# EasyEDA Pro project 电源板.epro

# Schematic Schematic2
Assembly Variant: Basic; Board Name: Board2; Create Date: 2026-05-31; Page Name: P1; Project Name: 信号电源板; Schematic Name: Schematic2; Update Date: 2026-05-31; BladeWidth: 10; Company: 嘉立创EDA; Page Size: A4; RegionStart: 1; ShowBorder: 1; TitleBlock: 1; TitleBlockPosition: 3; Version: V1.0; XRegionCount: 6; YRegionCount: 4
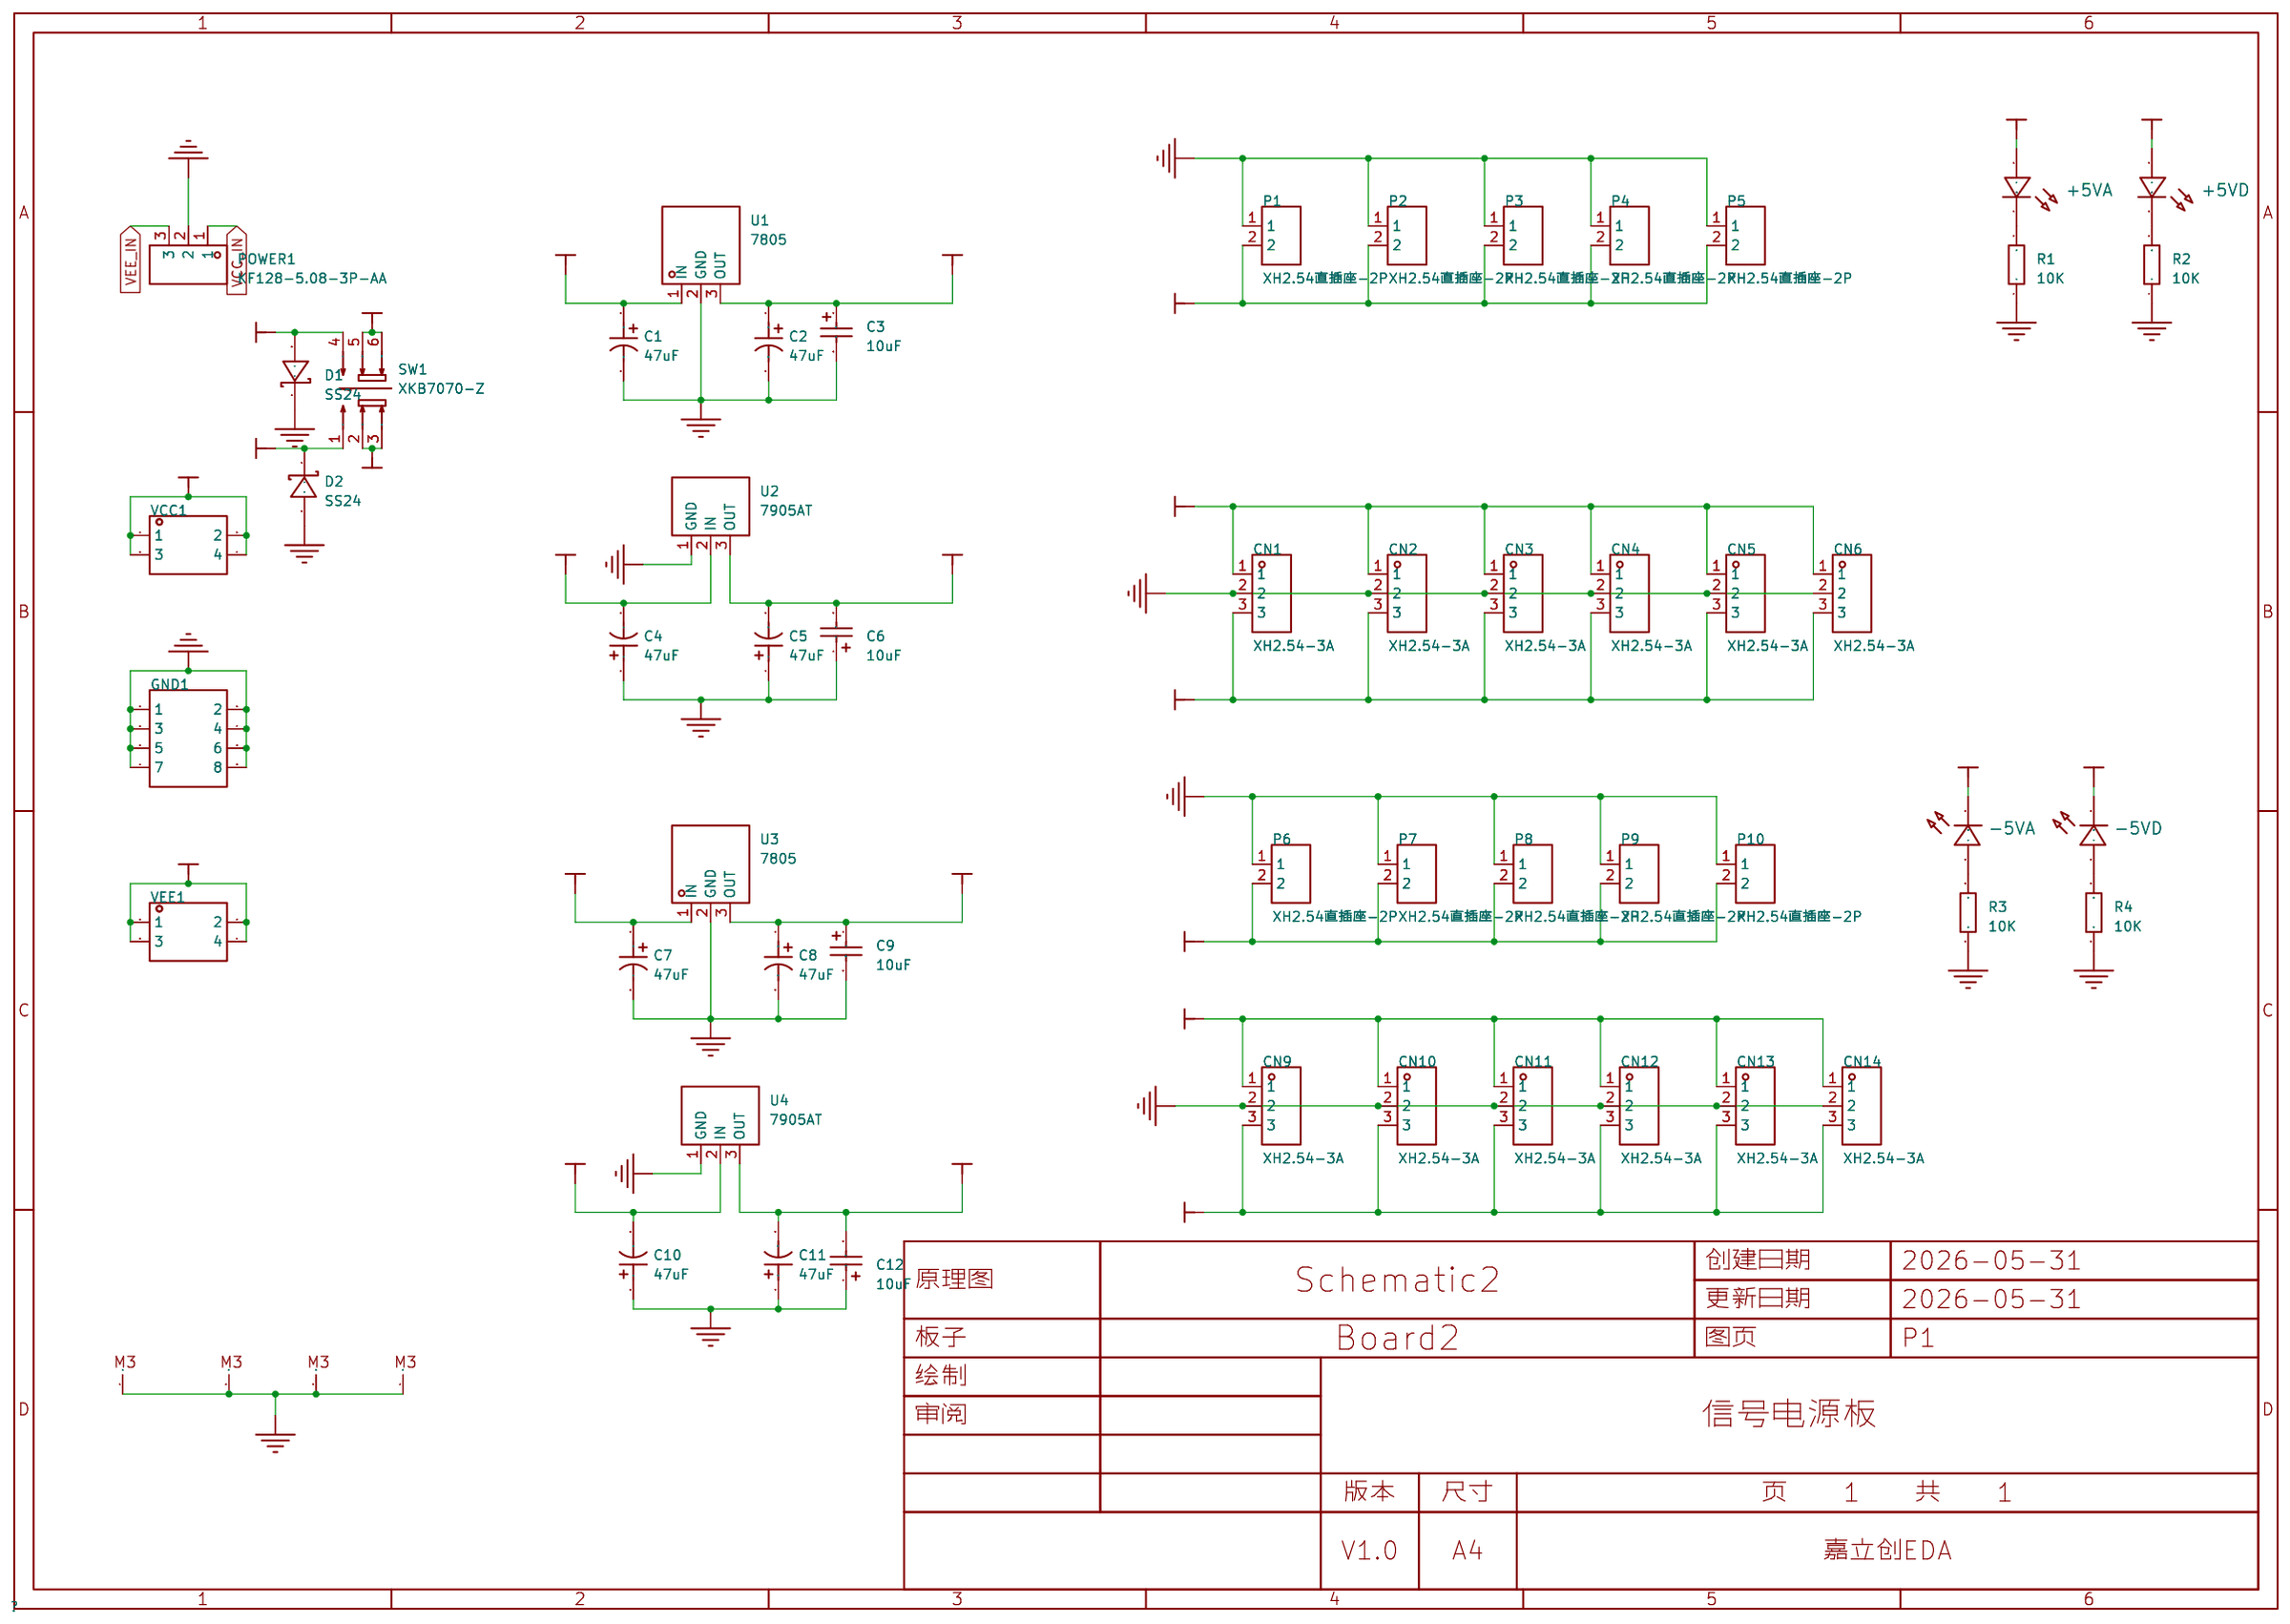
[diagram p0: schematic sheet]

## Parts
+5VA  -  [LED_0603]
+5VD  -  [LED_0603]
-5VA  -  [LED_0603]
-5VD  -  [LED_0603]
C1  47uF  [CAP-SMD_BD6.3-L6.6-W6.6-LS7.3-FD]
C2  47uF  [CAP-SMD_BD6.3-L6.6-W6.6-LS7.3-FD]
C3  10uF  [CAP-SMD_L3.2-W1.6-RD-C7171]
C4  47uF  [CAP-SMD_BD6.3-L6.6-W6.6-LS7.3-FD]
C5  47uF  [CAP-SMD_BD6.3-L6.6-W6.6-LS7.3-FD]
C6  10uF  [CAP-SMD_L3.2-W1.6-RD-C7171]
C7  47uF  [CAP-SMD_BD6.3-L6.6-W6.6-LS7.3-FD]
C8  47uF  [CAP-SMD_BD6.3-L6.6-W6.6-LS7.3-FD]
C9  10uF  [CAP-SMD_L3.2-W1.6-RD-C7171]
C10  47uF  [CAP-SMD_BD6.3-L6.6-W6.6-LS7.3-FD]
C11  47uF  [CAP-SMD_BD6.3-L6.6-W6.6-LS7.3-FD]
C12  10uF  [CAP-SMD_L3.2-W1.6-RD-C7171]
CN1  XH2.54-3A  [CONN-TH_3P-P2.50_HCTL_XH-3A-L]
CN2  XH2.54-3A  [CONN-TH_3P-P2.50_HCTL_XH-3A-L]
CN3  XH2.54-3A  [CONN-TH_3P-P2.50_HCTL_XH-3A-L]
CN4  XH2.54-3A  [CONN-TH_3P-P2.50_HCTL_XH-3A-L]
CN5  XH2.54-3A  [CONN-TH_3P-P2.50_HCTL_XH-3A-L]
CN6  XH2.54-3A  [CONN-TH_3P-P2.50_HCTL_XH-3A-L]
CN9  XH2.54-3A  [CONN-TH_3P-P2.50_HCTL_XH-3A-L]
CN10  XH2.54-3A  [CONN-TH_3P-P2.50_HCTL_XH-3A-L]
CN11  XH2.54-3A  [CONN-TH_3P-P2.50_HCTL_XH-3A-L]
CN12  XH2.54-3A  [CONN-TH_3P-P2.50_HCTL_XH-3A-L]
CN13  XH2.54-3A  [CONN-TH_3P-P2.50_HCTL_XH-3A-L]
CN14  XH2.54-3A  [CONN-TH_3P-P2.50_HCTL_XH-3A-L]
D1  SS24  [SMA_L4.3-W2.6-LS5.2-RD]
D2  SS24  [SMA_L4.3-W2.6-LS5.2-RD]
GND1  -  [HDR-TH_8P-P2.54-V-F-R2-C4-S2.54-1]
M1  -  [M3]
M2  -  [M3]
M3  -  [M3]
M4  -  [M3]
P1  XH2.54直插座-2P  [CONN-TH_XH2.54-2P]
P2  XH2.54直插座-2P  [CONN-TH_XH2.54-2P]
P3  XH2.54直插座-2P  [CONN-TH_XH2.54-2P]
P4  XH2.54直插座-2P  [CONN-TH_XH2.54-2P]
P5  XH2.54直插座-2P  [CONN-TH_XH2.54-2P]
P6  XH2.54直插座-2P  [CONN-TH_XH2.54-2P]
P7  XH2.54直插座-2P  [CONN-TH_XH2.54-2P]
P8  XH2.54直插座-2P  [CONN-TH_XH2.54-2P]
P9  XH2.54直插座-2P  [CONN-TH_XH2.54-2P]
P10  XH2.54直插座-2P  [CONN-TH_XH2.54-2P]
POWER1  KF128-5.08-3P-AA  [CONN-TH_3P-P5.08_KF128-5.08-3P]
R1  10K  [R0603]
R2  10K  [R0603]
R3  10K  [R0603]
R4  10K  [R0603]
SW1  XKB7070-Z  [SW-TH_6P-L7.0-W7.0-P2.00]
U1  7805  [TO-220-3_L10.2-W4.5-P2.54-L-1]
U2  7905AT  [TO-220AB-3_L10.1-W4.6-P2.54-L]
U3  7805  [TO-220-3_L10.2-W4.5-P2.54-L-1]
U4  7905AT  [TO-220AB-3_L10.1-W4.6-P2.54-L]
VCC1  -  [HDR-TH_4P-P2.54-V-F-R2-C2-S2.54]
VEE1  -  [HDR-TH_4P-P2.54-V-F-R2-C2-S2.54]

## Library data of the parts
+5VA +5VD -5VA -5VD = LED_0603-R: Supplier Footprint: 0603
C1 C2 C4 C5 C7 C8 C10 C11 = 126RV0104: 容值:47uF;精度:±20%;额定电压:63V;纹波电流:90mA;; LCSC Part Name: 47uF ±20% 63V; Supplier Part: C7461235; Manufacturer: KNSCHA(科尼盛); Supplier Footprint: SMD,D6.3xL7.7mm; JLCPCB Part Class: Extended Part; Datasheet: https://atta.szlcsc.com/upload/public/pdf/source/20230711/6451BDCB5B323B6F7EF00B061BF0BEEC.pdf; Supplier: LCSC; Tolerance: ±20%; Voltage Rating: 63V; Ripple Current: 90mA; Diameter: 6.3mm; Height - Seated (Max): 7.7mm; Lifetime: 2000hrs@105℃; Operating Temperature: -55℃~+105℃
C3 C6 C9 C12 = TAJA106K016RNJ: 容值:10uF;精度:±10%;额定电压:16V;等效串联电阻(ESR):3Ω@100kHz;; LCSC Part Name: 10uF ±10% 16V; Supplier Part: C7171; Manufacturer: Kyocera AVX; Supplier Footprint: CASE-A-3216-18(mm); JLCPCB Part Class: Basic Part; Supplier: LCSC; Tolerance: ±10%; Voltage Rating: 16V; Equivalent Series Resistance(ESR): 3Ω@100kHz; Operating Temperature: -55℃~+125℃
CN1-CN6 CN9-CN14 = XH2.54-3A: Supplier Part: C9900018379; JLCPCB Part Class: Extended Part; Supplier: LCSC
D1 D2 = SS24: 正向压降(Vf):550mV@2A;直流反向耐压(Vr):40V;平均整流电流(Io):2A;; LCSC Part Name: 电压:40V 电流:2A; Supplier Part: C13444; Supplier Footprint: SMA(DO-214AC); JLCPCB Part Class: Extended Part; Supplier: LCSC; Forward Voltage (Vf@If): 550mV@2A; Reverse Voltage (Vr): 40V; Average Rectified Current (Io): 2A
GND1 = HDR-F_2.54_2x4: Supplier Part: C92271; Supplier Footprint: 插件
M1-M4 = 螺丝孔
P1-P10 = XH2.54直插座-2P: Supplier Part: C9900016957; Supplier Footprint: XH2.54-2; JLCPCB Part Class: Extended Part; Supplier: LCSC
POWER1 = KF128-5.08-3P-AA: 结构:1x3P;间距:5.08mm;颜色:绿色;安装方式:直插;排数:1;每排PIN数:3;额定电流:24A;额定电压:250V;线规 - AWG:12~22;线规 - 平方毫米:2.5;工作温度:-40℃~+105℃;; LCSC Part Name: 1x3P 5.08mm 直插 排数:1 每排P数:3; Supplier Part: C474953; Manufacturer: KEFA(科发); Supplier Footprint: 插件,P=5.08mm; JLCPCB Part Class: Extended Part; Datasheet: https://item.szlcsc.com/datasheet/KF128-5.08-3P-AA/481571.html; Supplier: LCSC; Number of Positions or Pins: 1x3P; Pitch: 5.08mm; Color: 绿色; Mounting Type: 直插; Number of Pins: 3P; Number of Rows: 1; Number of PINs Per Row: 3; Current Rating: 24A; Voltage Rating (Max): 250V; Wire Gauge - AWG: 12~22; Wire Gauge - mm2: 2.5; Operating Temperature: -40℃~+105℃
R1-R4 = Res_0603: Supplier Footprint: 0603
SW1 = XKB7070-Z: 自锁/无锁:自锁;安装方式:直插;触点电流:100mA;额定电压:30V;带灯:不带;作用力:1.6N;工作寿命:10万次;; LCSC Part Name: 按键开关   7*7插件自锁 蓝白黑; Supplier Part: C318863; Manufacturer: XKB Connection(中国星坤); Supplier Footprint: 插件; JLCPCB Part Class: Extended Part; Datasheet: https://item.szlcsc.com/datasheet/XKB7070-Z/299955.html; Supplier: LCSC; Self Lock / No Lock: 自锁; Actuator Style: 矩形按钮; Mounting Type: 直插; Contact Current: 100mA; Voltage Rating: 30V; Actuator/Cap Color: 蓝色; With Lamp: 不带; Termination Style: PC引脚; Operating Force: 1.6N; Operating Temperature: -15℃~+55℃; Life: 10万次
U1 U3 = 7805: 输出类型:固定;最大输入电压:35V;输出电压:5V;最大输出电流:1.5A;电源纹波抑制比(PSRR):62dB@(120Hz);输出极性:正极;; LCSC Part Name: 输入35V 输出5V 1.5A; Supplier Part: C4944936; Manufacturer: SY(顺烨); Supplier Footprint: TO-220AB; JLCPCB Part Class: Extended Part; Datasheet: https://atta.szlcsc.com/upload/public/pdf/source/20220719/323A3F14557C229271C454C7C0F759A5.pdf; Supplier: LCSC; Output Type: 固定; Maximum Input Voltage: 35V; Output Voltage: 5V; MAX Output Current: 1.5A; Power Supply Rejection Ratio (PSRR): 62dB@(120Hz); Output Polarity: 正极
U2 U4 = 7905AT: 输出类型:固定;工作电压:-;输出电压:5V;输出电流:1.5A;电源纹波抑制比(PSRR):60dB@(120Hz);输出极性:负极;; Supplier Part: C45662283; Manufacturer: YFW(佑风微); Supplier Footprint: TO-220AB; Datasheet: https://atta.szlcsc.com/upload/public/pdf/source/20250225/F51238B376FA73B223788C2EF1ED6222.pdf; Supplier: LCSC; Output Type: 固定; Output Voltage: 5V; Output Current: 1.5A; Power Supply Rejection Ratio (PSRR): 60dB@(120Hz); Voltage Dropout: 2V@(1A); standby current: 6mA; Noise: 40uV; Output Configuration: 负极
VCC1 VEE1 = HDR-F_2.54_2x2: Supplier Part: C92273; Supplier Footprint: 插件

## Nets
+5VA: +5VA.2(A) C2.1 C3.1 CN1.1 CN2.1 CN3.1 CN4.1 CN5.1 CN6.1 P1.2 P2.2 P3.2 P4.2 P5.2 U1.3(OUT)
+5VD: +5VD.2(A) C8.1 C9.1 CN9.1 CN10.1 CN11.1 CN12.1 CN13.1 CN14.1 P6.2 P7.2 P8.2 P9.2 P10.2 U3.3(OUT)
-5VA: -5VA.1(C) C5.2 C6.2 CN1.3 CN2.3 CN3.3 CN4.3 CN5.3 CN6.3 U2.3(OUT)
-5VD: -5VD.1(C) C11.2 C12.2 CN9.3 CN10.3 CN11.3 CN12.3 CN13.3 CN14.3 U4.3(OUT)
GND: C1.2 C2.2 C3.2 C4.1 C5.1 C6.1 C7.2 C8.2 C9.2 C10.1 C11.1 C12.1 CN1.2 CN2.2 CN3.2 CN4.2 CN5.2 CN6.2 CN9.2 CN10.2 CN11.2 CN12.2 CN13.2 CN14.2 D1.1(K) D2.2(A) GND1.1 GND1.2 GND1.3 GND1.4 GND1.5 GND1.6 GND1.7 GND1.8 M1.1 M2.1 M3.1 M4.1 P1.1 P2.1 P3.1 P4.1 P5.1 P6.1 P7.1 P8.1 P9.1 P10.1 POWER1.2 R1.1 R2.1 R3.1 R4.1 U1.2(GND) U2.1(GND) U3.2(GND) U4.1(GND)
VCC: C1.1 C7.1 D1.2(A) SW1.4 U1.1(IN) U3.1(IN)
VCC_IN: POWER1.1 SW1.5 SW1.6 VEE1.1 VEE1.2 VEE1.3 VEE1.4
VEE: C4.2 C10.2 D2.1(K) SW1.1 U2.2(IN) U4.2(IN)
VEE_IN: POWER1.3 SW1.2 SW1.3 VCC1.1 VCC1.2 VCC1.3 VCC1.4
Net-(+5VA-1): +5VA.1(C) R1.2
Net-(+5VD-1): +5VD.1(C) R2.2
Net-(-5VA-2): -5VA.2(A) R3.2
Net-(-5VD-2): -5VD.2(A) R4.2

# Board PCB2
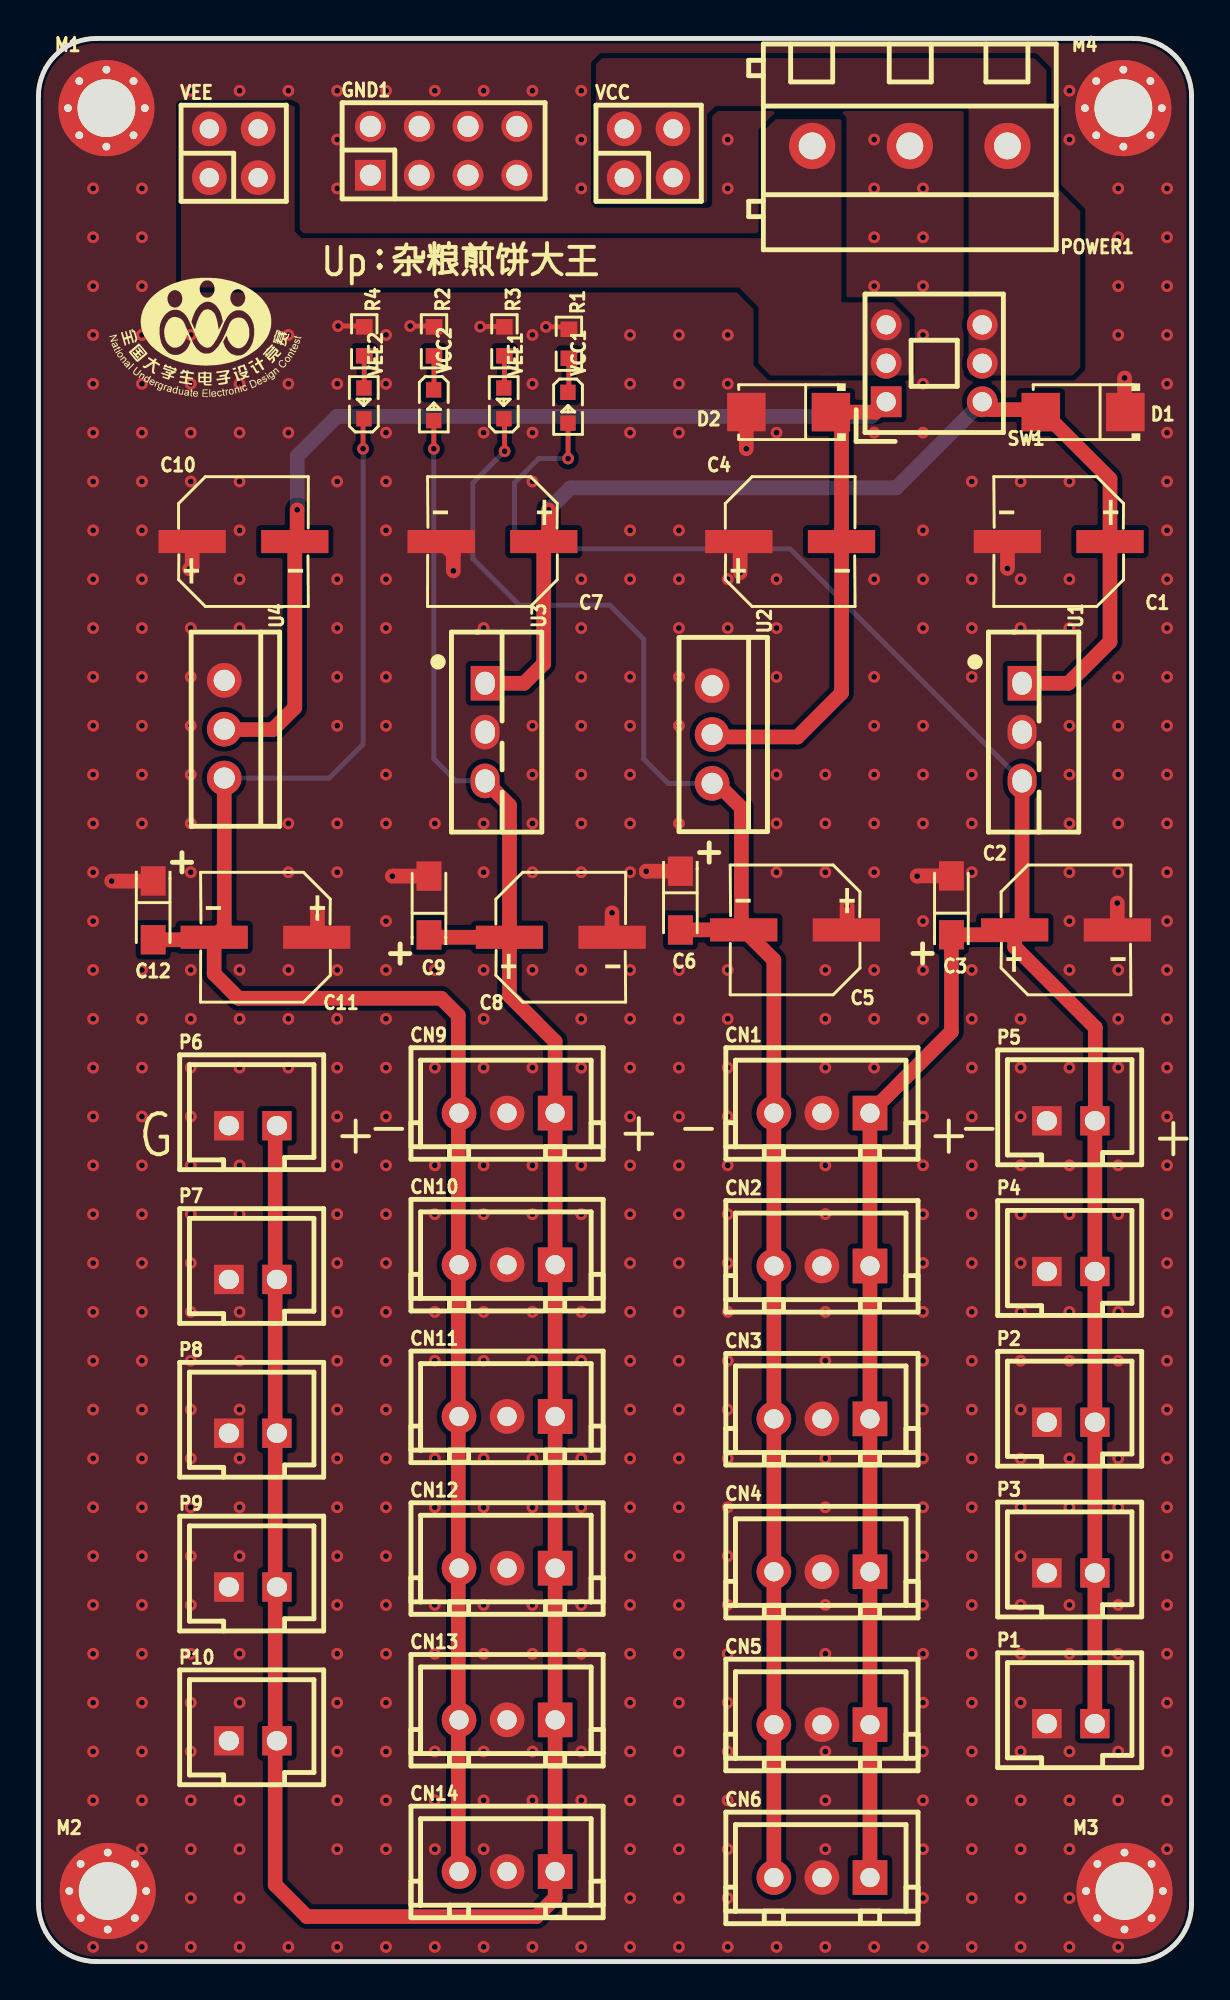
[diagram p1: board, top side]
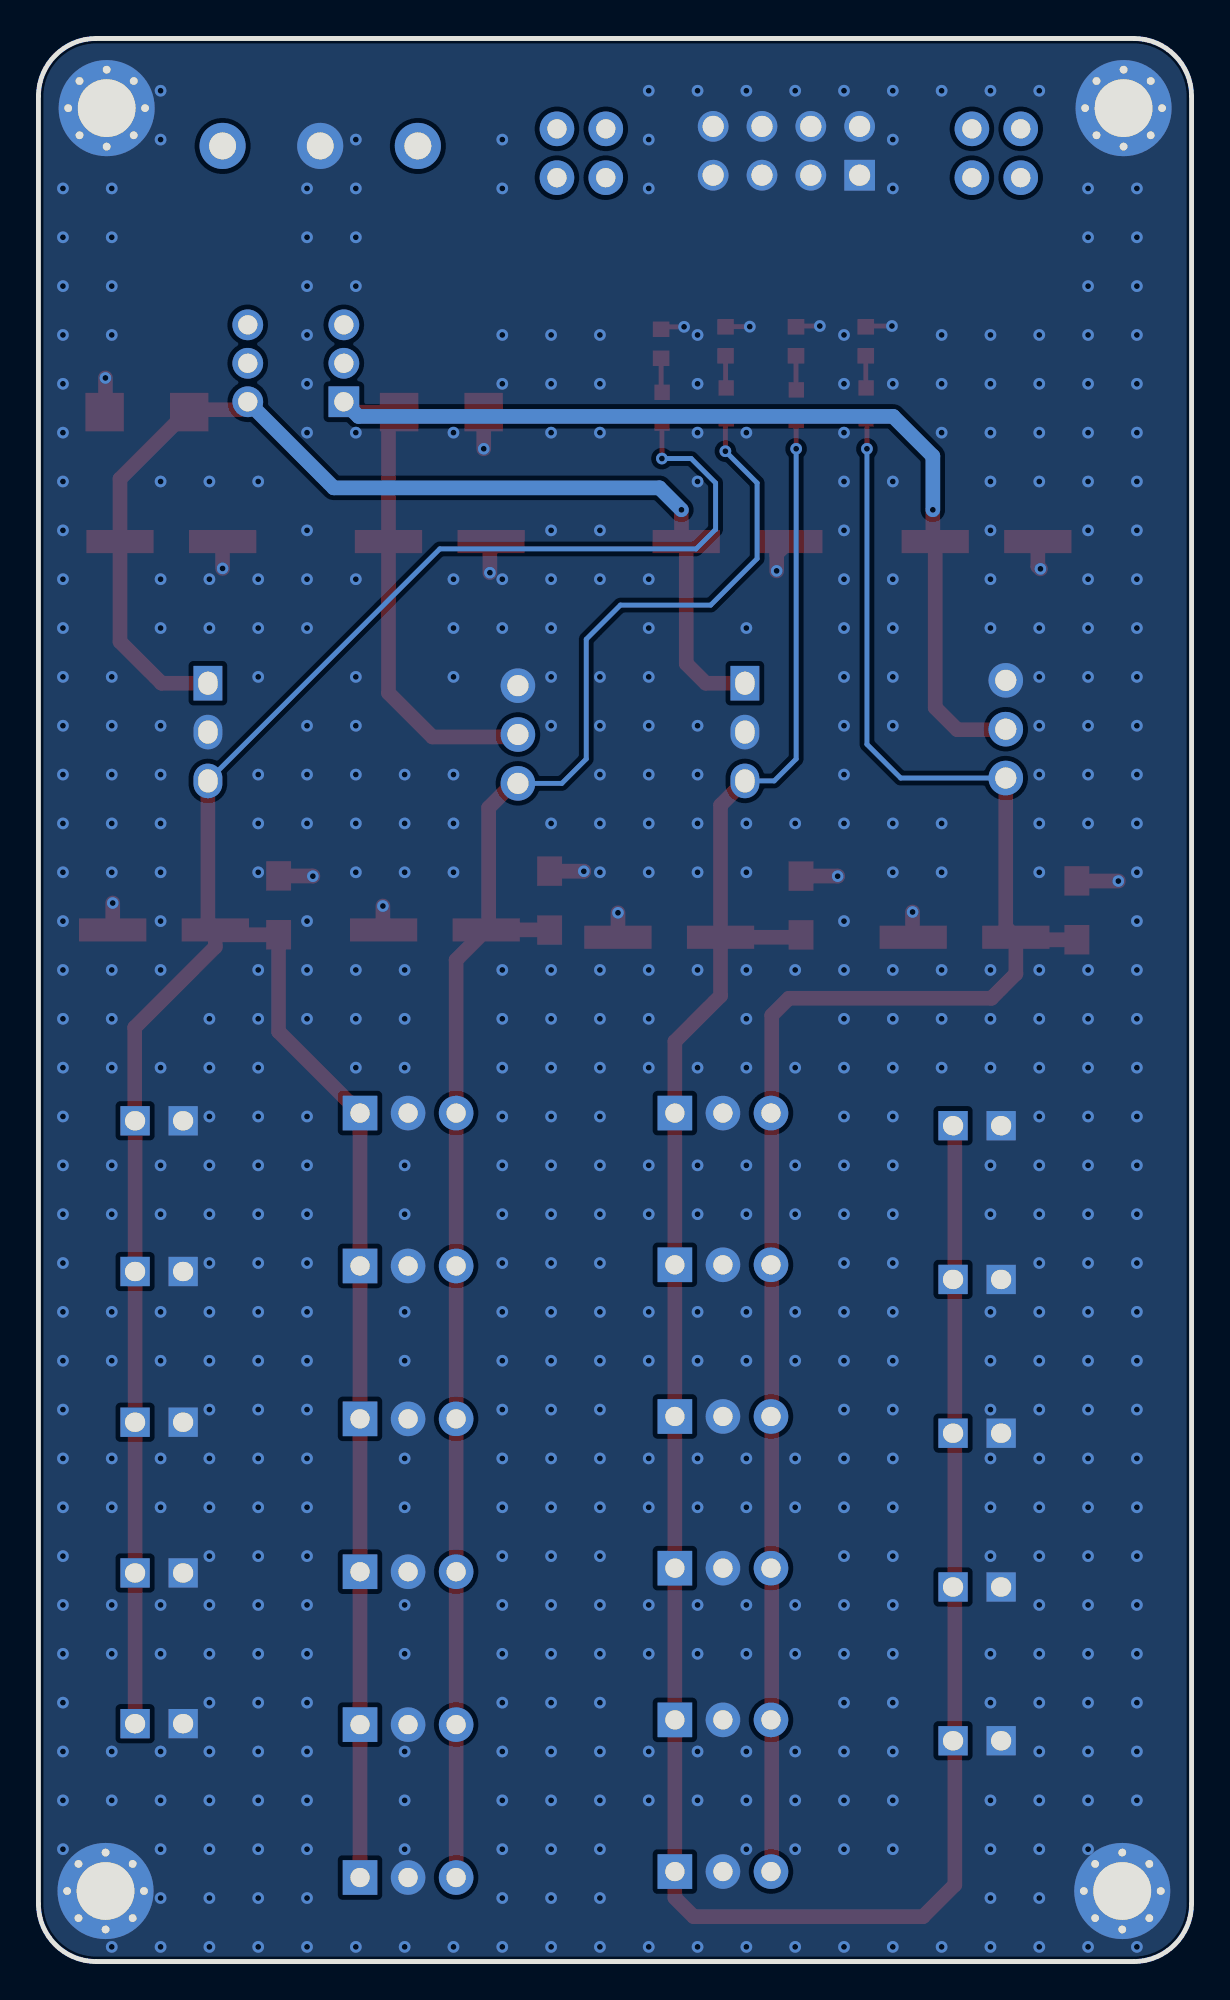
[diagram p2: board, bottom side, seen from below]

Outline 60 x 100 mm; copper layers: Top Layer, Bottom Layer. Coordinates in mm from the lower left corner of the outline.
Outline path: 0,97 0,3 arc(0.88,0.88) 3,0 57,0 arc(59.12,0.88) 60,3 60,97 arc(59.12,99.12) 57,100 3,100 arc(0.88,99.12) 0,97
Stack: Top Layer 0.035mm / Dielectric1 1.51mm FR4 er 4.5 / Bottom Layer 0.035mm

## Design rules (mm)
spacing copperThickness1oz (default): track to track 0.102, other pairs 0.152 to 0.3
spacing copperThickness2oz: track to track 0.203, other pairs 0.152 to 0.3
track width POWER (default): min 0.127, default 0.762, max 2.54
track width copperThickness1oz: min 0.127, default 0.254, max 2.54
track width copperThickness2oz: min 0.203, default 0.254, max 2.54
differential pair differentialPair (default): width min 0.127, default 0.254, max 2.54; gap min 0.152, default 0.152
net GND uses copperRegion
net VCC uses copperRegion
net VEE_IN uses copperRegion
net VCC_IN uses copperRegion

## Placement (name value [footprint] x y rotation side)
C1  47uF  [CAP-SMD_BD6.3-L6.6-W6.6-LS7.3-FD]  53.09 73.84 180 top
C2  47uF  [CAP-SMD_BD6.3-L6.6-W6.6-LS7.3-FD]  53.47 53.64 0 top
C3  10uF  [CAP-SMD_L3.2-W1.6-RD-C7171]  47.5 54.92 90 top
C4  47uF  [CAP-SMD_BD6.3-L6.6-W6.6-LS7.3-FD]  39.12 73.84 0 top
C5  47uF  [CAP-SMD_BD6.3-L6.6-W6.6-LS7.3-FD]  39.37 53.65 180 top
C6  10uF  [CAP-SMD_L3.2-W1.6-RD-C7171]  33.4 55.17 270 top
C7  47uF  [CAP-SMD_BD6.3-L6.6-W6.6-LS7.3-FD]  23.62 73.84 180 top
C8  47uF  [CAP-SMD_BD6.3-L6.6-W6.6-LS7.3-FD]  27.18 53.26 0 top
C9  10uF  [CAP-SMD_L3.2-W1.6-RD-C7171]  20.32 54.92 90 top
C10  47uF  [CAP-SMD_BD6.3-L6.6-W6.6-LS7.3-FD]  10.67 73.84 0 top
C11  47uF  [CAP-SMD_BD6.3-L6.6-W6.6-LS7.3-FD]  11.81 53.26 180 top
C12  10uF  [CAP-SMD_L3.2-W1.6-RD-C7171]  5.97 54.66 270 top
CN1  XH2.54-3A  [CONN-TH_3P-P2.50_HCTL_XH-3A-L]  40.77 44.12 0 top
CN2  XH2.54-3A  [CONN-TH_3P-P2.50_HCTL_XH-3A-L]  40.77 36.17 0 top
CN3  XH2.54-3A  [CONN-TH_3P-P2.50_HCTL_XH-3A-L]  40.77 28.22 0 top
CN4  XH2.54-3A  [CONN-TH_3P-P2.50_HCTL_XH-3A-L]  40.77 20.27 0 top
CN5  XH2.54-3A  [CONN-TH_3P-P2.50_HCTL_XH-3A-L]  40.77 12.32 0 top
CN6  XH2.54-3A  [CONN-TH_3P-P2.50_HCTL_XH-3A-L]  40.77 4.37 0 top
CN9  XH2.54-3A  [CONN-TH_3P-P2.50_HCTL_XH-3A-L]  24.38 44.12 0 top
CN10  XH2.54-3A  [CONN-TH_3P-P2.50_HCTL_XH-3A-L]  24.38 36.23 0 top
CN11  XH2.54-3A  [CONN-TH_3P-P2.50_HCTL_XH-3A-L]  24.38 28.34 0 top
CN12  XH2.54-3A  [CONN-TH_3P-P2.50_HCTL_XH-3A-L]  24.38 20.46 0 top
CN13  XH2.54-3A  [CONN-TH_3P-P2.50_HCTL_XH-3A-L]  24.38 12.57 0 top
CN14  XH2.54-3A  [CONN-TH_3P-P2.50_HCTL_XH-3A-L]  24.38 4.68 0 top
D1  SS24  [SMA_L4.3-W2.6-LS5.2-RD]  54.36 80.57 180 top
D2  SS24  [SMA_L4.3-W2.6-LS5.2-RD]  39.03 80.57 180 top
GND1  -  [HDR-TH_8P-P2.54-V-F-R2-C4-S2.54-1]  21.08 94.16 0 top
M1  -  [M3]  3.54 96.38 0 top
M2  -  [M3]  3.61 3.67 0 top
M3  -  [M3]  56.51 3.67 0 top
M4  -  [M3]  56.45 96.38 0 top
P1  XH2.54直插座-2P  [CONN-TH_XH2.54-2P]  53.72 12.37 0 top
P2  XH2.54直插座-2P  [CONN-TH_XH2.54-2P]  53.72 28.04 0 top
P3  XH2.54直插座-2P  [CONN-TH_XH2.54-2P]  53.72 20.21 0 top
P4  XH2.54直插座-2P  [CONN-TH_XH2.54-2P]  53.72 35.88 0 top
P5  XH2.54直插座-2P  [CONN-TH_XH2.54-2P]  53.72 43.72 0 top
P6  XH2.54直插座-2P  [CONN-TH_XH2.54-2P]  11.16 43.46 0 top
P7  XH2.54直插座-2P  [CONN-TH_XH2.54-2P]  11.16 35.47 0 top
P8  XH2.54直插座-2P  [CONN-TH_XH2.54-2P]  11.16 27.47 0 top
P9  XH2.54直插座-2P  [CONN-TH_XH2.54-2P]  11.16 19.48 0 top
P10  XH2.54直插座-2P  [CONN-TH_XH2.54-2P]  11.16 11.48 0 top
POWER1  KF128-5.08-3P-AA  [CONN-TH_3P-P5.08_KF128-5.08-3P]  45.34 94.41 180 top
R1  10K  [R0603]  27.6 84.12 270 top
R2  10K  [R0603]  20.58 84.25 270 top
R3  10K  [R0603]  24.25 84.25 270 top
R4  10K  [R0603]  16.95 84.25 270 top
SW1  XKB7070-Z  [SW-TH_6P-L7.0-W7.0-P2.00]  46.61 83.11 180 top
U1  7805  [TO-220-3_L10.2-W4.5-P2.54-L-1]  51.18 63.93 270 top
U2  7905AT  [TO-220AB-3_L10.1-W4.6-P2.54-L]  35.05 63.81 270 top
U3  7805  [TO-220-3_L10.2-W4.5-P2.54-L-1]  23.24 63.93 270 top
U4  7905AT  [TO-220AB-3_L10.1-W4.6-P2.54-L]  9.67 64.08 270 top
VCC  -  [HDR-TH_4P-P2.54-V-F-R2-C2-S2.54]  31.75 94.03 0 top
VCC1  -  [LED_0603]  27.56 80.75 270 top
VCC2  -  [LED_0603]  20.57 80.88 270 top
VEE  -  [HDR-TH_4P-P2.54-V-F-R2-C2-S2.54]  10.16 94.03 0 top
VEE1  -  [LED_0603]  24.21 81.08 90 top
VEE2  -  [LED_0603]  16.93 81.08 90 top

## Footprints (pads in the part's own frame, mm; a bottom-side part is the same pattern mirrored in y, then rotated)
CAP-SMD_BD6.3-L6.6-W6.6-LS7.3-FD
  rect 3.5x1.2 smd: 1(-2.67,0) 2(2.67,0)
CAP-SMD_L3.2-W1.6-RD-C7171
  rect 1.53x1.296 smd: 1(-1.53,0) 2(1.53,0)
CONN-TH_3P-P2.50_HCTL_XH-3A-L
  rect 1.8x1.8 hole 1: 1(2.5,0)
  round 1.8 hole 1: 2(0,0) 3(-2.5,0)
CONN-TH_3P-P5.08_KF128-5.08-3P
  round 2.4 hole 1.4: 1(-5.08,0) 2(0,0) 3(5.08,0)
CONN-TH_XH2.54-2P
  rect 1.524x1.524 hole 1.05x1: 1(-1.25,0) 2(1.25,0)
HDR-TH_4P-P2.54-V-F-R2-C2-S2.54
  round 1.8 hole 1: 1(-1.27,-1.27) 2(-1.27,1.27) 3(1.27,-1.27) 4(1.27,1.27)
HDR-TH_8P-P2.54-V-F-R2-C4-S2.54-1
  rect 1.6x1.6 hole 1.1: 1(-3.81,-1.27)
  round 1.6 hole 1.1: 2(-3.81,1.27) 3(-1.27,-1.27) 4(-1.27,1.27) 5(1.27,-1.27) 6(1.27,1.27) 7(3.81,-1.27) 8(3.81,1.27)
LED_0603
  rect 0.8x0.8 smd: 1(-0.851,-0.01) 2(0.75,-0.005)
M3
  round 0.6 hole 0.405x0.4: 1(-2,0) 1(-1.41,1.41) 1(-1.41,-1.41) 1(0,2) 1(0,-2) 1(1.41,1.41) 1(1.41,-1.41) 1(2,0)
  round 5 hole 3.005x3: 1(0,0)
R0603
  rect 0.806x0.864 smd: 1(-0.753,0) 2(0.753,0)
SMA_L4.3-W2.6-LS5.2-RD
  rect 2x2 smd: 1(-2.2,0) 2(2.2,0)
SW-TH_6P-L7.0-W7.0-P2.00
  rect 1.6x1.6 hole 1: 1(2.499,2)
  round 1.6 hole 1: 2(2.5,0) 3(2.5,-2) 4(-2.5,2) 5(-2.5,0) 6(-2.5,-2)
TO-220-3_L10.2-W4.5-P2.54-L-1
  rect 1.8x1.5 hole 1.2x1: 1(-2.54,0)
  oval 1.8x1.5 hole 1.2x1: 2(0,0) 3(2.54,0)
TO-220AB-3_L10.1-W4.6-P2.54-L
  round 1.8 hole 1.1: 1(-2.54,0) 2(0,0) 3(2.54,0)

## Nets
+5VA: C2.1 C3.1 CN1.1 CN2.1 CN3.1 CN4.1 CN5.1 CN6.1 P1.2 P2.2 P3.2 P4.2 P5.2 U1.3 VCC1.2
+5VD: C8.1 C9.1 CN9.1 CN10.1 CN11.1 CN12.1 CN13.1 CN14.1 P6.2 P7.2 P8.2 P9.2 P10.2 U3.3 VCC2.2
-5VA: C5.2 C6.2 CN1.3 CN2.3 CN3.3 CN4.3 CN5.3 CN6.3 U2.3 VEE1.1
-5VD: C11.2 C12.2 CN9.3 CN10.3 CN11.3 CN12.3 CN13.3 CN14.3 U4.3 VEE2.1
GND: C1.2 C2.2 C3.2 C4.1 C5.1 C6.1 C7.2 C8.2 C9.2 C10.1 C11.1 C12.1 CN1.2 CN2.2 CN3.2 CN4.2 CN5.2 CN6.2 CN9.2 CN10.2 CN11.2 CN12.2 CN13.2 CN14.2 D1.1 D2.2 GND1.1 GND1.2 GND1.3 GND1.4 GND1.5 GND1.6 GND1.7 GND1.8 M1.1 M2.1 M3.1 M4.1 P1.1 P2.1 P3.1 P4.1 P5.1 P6.1 P7.1 P8.1 P9.1 P10.1 POWER1.2 R1.1 R2.1 R3.1 R4.1 U1.2 U2.1 U3.2 U4.1
VCC: C1.1 C7.1 D1.2 SW1.4 U1.1 U3.1
VCC_IN: POWER1.1 SW1.5 SW1.6 VCC.1 VCC.2 VCC.3 VCC.4
VEE: C4.2 C10.2 D2.1 SW1.1 U2.2 U4.2
VEE_IN: POWER1.3 SW1.2 SW1.3 VEE.1 VEE.2 VEE.3 VEE.4
$1N38: R1.2 VCC1.1
$1N41: R2.2 VCC2.1
$1N46: R3.2 VEE1.2
$1N47: R4.2 VEE2.2

## Via types
v1: diameter 0.61, hole 0.305, Top Layer to Bottom Layer, 602 vias

## Routing (per net, layer and track width the routed paths; a pad name or vN(x,y) marks a point on that pad's centre or on a via; arc(x,y) is an arc through that point)
+5VA: length 144.5
  Top Layer w0.254: v1(27.56,78.16) 27.56,80 VCC1.2
  Top Layer w0.762: CN6.1 CN5.1 CN4.1 CN3.1 CN2.1 CN1.1 47.5,48.36 C3.1 50.54,53.39 50.8,53.64 ; 50.8,53.64 51.18,54.03 U1.3 ; 50.8,53.64 50.8,52.76 54.99,48.56 54.99,43.74 P5.2 P4.2 P2.2 P3.2 P1.2
  Bottom Layer w0.254: U1.3 39.12,73.46 25.78,73.46 24.76,74.47 24.76,76.89 26.03,78.16 v1(27.56,78.16)
+5VD: length 139.7
  Top Layer w0.254: v1(20.57,78.66) 20.57,80.12 20.57,80.13
  Top Layer w0.762: C9.1 20.44,53.26 C8.1 ; C8.1 24.51,60.12 U3.3 ; C8.1 24.51,50.22 26.88,47.84 CN9.1 CN10.1 CN11.1 CN12.1 CN13.1 CN14.1 26.88,3.31 25.91,2.34 13.97,2.34 12.32,3.99 12.32,43.37 P6.2
  Bottom Layer w0.254: v1(20.57,78.66) 20.57,62.53 21.72,61.39 U3.3
-5VA: length 90.6
  Top Layer w0.254: v1(24.26,78.54) 24.26,80.19 VEE1.1
  Top Layer w0.762: U2.3 35.31,61.27 36.58,60 36.58,53.77 C5.2 ; C5.2 38.27,52.08 CN1.3 CN2.3 CN3.3 CN4.3 CN5.3 CN6.3 ; C5.2 33.41,53.65 C6.2
  Bottom Layer w0.254: U2.3 32.77,61.27 31.5,62.53 31.5,68.76 29.72,70.54 25.02,70.54 22.61,72.95 22.61,76.89 v1(24.26,78.54)
-5VD: length 96.7
  Top Layer w0.254: VEE2.1 16.89,80.18 v1(16.89,78.66)
  Top Layer w0.762: 9.14,53.26 9.01,53.13 C12.2 ; 9.14,53.26 9.67,53.79 U4.3 ; 9.14,53.26 9.14,51.36 10.41,50.09 20.96,50.09 21.84,49.2 21.84,4.72 CN14.3
  Bottom Layer w0.254: U4.3 15.14,61.54 16.89,63.3 v1(16.89,78.66)
GND: length 28
  Top Layer w0.254: R2.1 20.54,85.05 v1(19.34,85.05) ; v1(26.41,85.01) 27.47,85.01 R1.1 ; R4.1 16.91,85.05 v1(15.59,85.05) ; R3.1 24.24,85.01 v1(22.99,85.01)
  Top Layer w0.762: D2.2 36.83,80.56 v1(36.83,78.66) ; v1(31.62,56.69) 31.63,56.7 C6.1 ; v1(18.41,56.44) 18.42,56.44 20.32,56.44 ; C12.1 5.96,56.19 v1(3.81,56.19) ; v1(36.51,72.22) 36.51,73.78 C4.1 ; C2.2 56.13,53.65 v1(56.13,55.04) ; C1.2 50.42,73.84 v1(50.42,72.44) ; v1(14.52,54.58) 14.52,53.3 C11.1 ; v1(29.84,54.53) 29.84,53.27 C8.2 ; C3.2 45.73,56.45 v1(45.72,56.44) ; C10.1 8,72.55 v1(7.86,72.42) ; v1(56.51,82.35) 56.51,80.61 D1.1 ; v1(21.59,72.31) 21.59,73.2 C7.2 ; C5.1 42.08,53.68 v1(42.08,54.89)
  vias: v1(2.84,92.2) v1(2.84,89.66) v1(2.84,87.12) v1(2.84,84.58) v1(2.84,82.04) v1(2.84,79.5) v1(2.84,76.96) v1(2.84,74.42) v1(2.84,71.88) v1(2.84,69.34) v1(2.84,66.8) v1(2.84,64.26) v1(2.84,61.72) v1(2.84,59.18) v1(2.84,56.64) v1(2.84,54.1) v1(2.84,51.56) v1(2.84,49.02) v1(2.84,46.48) v1(2.84,43.94) v1(2.84,41.4) v1(2.84,38.86) v1(2.84,36.32) v1(2.84,33.78) v1(2.84,31.24) v1(2.84,28.7) v1(2.84,26.16) v1(2.84,23.62) v1(2.84,21.08) v1(2.84,18.54) v1(2.84,16) v1(2.84,13.46) v1(2.84,10.92) v1(2.84,8.38) v1(2.84,0.76) v1(5.39,92.2) v1(5.39,89.66) v1(5.39,87.12) v1(5.39,84.58) v1(5.39,82.04) v1(5.39,79.5) v1(5.39,76.96) v1(5.39,74.42) v1(5.39,71.88) v1(5.39,69.34) v1(5.39,66.8) v1(5.39,64.26) v1(5.39,61.72) v1(5.39,59.18) v1(5.39,51.56) v1(5.39,49.02) v1(5.39,46.48) v1(5.39,43.94) v1(5.39,41.4) v1(5.39,38.86) v1(5.39,36.32) v1(5.39,33.78) v1(5.39,31.24) v1(5.39,28.7) v1(5.39,26.16) v1(5.39,23.62) v1(5.39,21.08) v1(5.39,18.54) v1(5.39,16) v1(5.39,13.46) v1(5.39,10.92) v1(5.39,8.38) v1(5.39,5.84) v1(5.39,0.76) v1(7.92,97.28) v1(7.92,84.58) v1(7.92,82.04) v1(7.92,79.5) v1(7.92,76.96) v1(7.92,69.34) v1(7.92,66.8) v1(7.92,64.26) v1(7.92,61.72) v1(7.92,59.18) v1(7.92,56.64) v1(7.92,51.56) v1(7.92,49.02) v1(7.92,46.48) v1(7.92,43.94) v1(7.92,41.4) v1(7.92,38.86) v1(7.92,36.32) v1(7.92,33.78) v1(7.92,31.24) v1(7.92,28.7) v1(7.92,26.16) v1(7.92,23.62) v1(7.92,21.08) v1(7.92,18.54) v1(7.92,16) v1(7.92,13.46) v1(7.92,10.92) v1(7.92,8.38) v1(7.92,5.84) v1(7.92,3.3) v1(7.92,0.76) v1(10.47,97.28) v1(10.47,84.58) v1(10.47,82.04) v1(10.47,79.5) v1(10.47,76.96) v1(10.47,74.42) v1(10.47,71.88) v1(10.47,69.34) v1(10.47,51.56) v1(10.47,49.02) v1(10.47,46.48) v1(10.47,41.4) v1(10.47,38.86) v1(10.47,33.78) v1(10.47,31.24) v1(10.47,28.7) v1(10.47,26.16) v1(10.47,23.62) v1(10.47,21.08) v1(10.47,16) v1(10.47,13.46) v1(10.47,8.38) v1(10.47,5.84) v1(10.47,3.3) v1(10.47,0.76) v1(13,97.28) v1(13,84.58) v1(13,82.04) v1(13,79.5) v1(13,59.18) v1(13,56.64) v1(13,51.56) v1(13,49.02) v1(13,46.48) v1(13,0.76) v1(15.54,97.28) v1(15.54,94.74) v1(15.54,92.2) v1(15.54,82.04) v1(15.54,76.96) v1(15.54,71.88) v1(15.54,69.34) v1(15.54,66.8) v1(15.54,64.26) v1(15.54,59.18) v1(15.54,56.64) v1(15.54,51.56) v1(15.54,49.02) v1(15.54,46.48) v1(15.54,43.94) v1(15.54,41.4) v1(15.54,38.86) v1(15.54,36.32) v1(15.54,33.78) v1(15.54,31.24) v1(15.54,28.7) v1(15.54,26.16) v1(15.54,23.62) v1(15.54,21.08) v1(15.54,18.54) v1(15.54,16) v1(15.54,13.46) v1(15.54,10.92) v1(15.54,8.38) v1(15.54,5.84) v1(15.54,0.76) v1(18.09,97.28) v1(18.09,84.58) v1(18.09,82.04) v1(18.09,79.5) v1(18.09,76.96) v1(18.09,74.42) v1(18.09,71.88) v1(18.09,69.34) v1(18.09,66.8) v1(18.09,64.26) v1(18.09,61.72) v1(18.09,59.18) v1(18.09,54.1) v1(18.09,51.56) v1(18.09,49.02) v1(18.09,46.48) v1(18.09,43.94) v1(18.09,41.4) v1(18.09,38.86) v1(18.09,36.32) v1(18.09,33.78) v1(18.09,31.24) v1(18.09,28.7) v1(18.09,26.16) v1(18.09,23.62) v1(18.09,21.08) v1(18.09,18.54) v1(18.09,16) v1(18.09,13.46) v1(18.09,10.92) v1(18.09,8.38) v1(18.09,5.84) v1(18.09,0.76) v1(20.62,97.28) v1(20.62,59.18) v1(20.62,51.56) v1(20.62,46.48) v1(20.62,41.4) v1(20.62,38.86) v1(20.62,33.78) v1(20.62,31.24) v1(20.62,26.16) v1(20.62,23.62) v1(20.62,18.54) v1(20.62,16) v1(20.62,10.92) v1(20.62,8.38) v1(20.62,5.84) v1(20.62,0.76) v1(23.16,97.28) v1(23.16,79.5) v1(23.16,69.34) v1(23.16,59.18) v1(23.16,56.64) v1(23.16,51.56) v1(23.16,49.02) v1(23.16,46.48) v1(23.16,41.4) v1(23.16,38.86) v1(23.16,33.78) v1(23.16,31.24) v1(23.16,26.16) v1(23.16,23.62) v1(23.16,18.54) v1(23.16,16) v1(23.16,10.92) v1(23.16,8.38) v1(23.16,5.84) v1(23.16,0.76) v1(25.71,97.28) v1(25.71,84.58) v1(25.71,82.04) v1(25.71,79.5) v1(25.71,76.96) v1(25.71,64.26) v1(25.71,61.72) v1(25.71,59.18) v1(25.71,56.64) v1(25.71,51.56) v1(25.71,46.48) v1(25.71,41.4) v1(25.71,38.86) v1(25.71,33.78) v1(25.71,31.24) v1(25.71,26.16) v1(25.71,23.62) v1(25.71,18.54) v1(25.71,16) v1(25.71,10.92) v1(25.71,8.38) v1(25.71,0.76) v1(28.25,97.28) v1(28.25,94.74) v1(28.25,92.2) v1(28.25,71.88) v1(28.25,69.34) v1(28.25,66.8) v1(28.25,64.26) v1(28.25,61.72) v1(28.25,59.18) v1(28.25,56.64) v1(28.25,51.56) v1(28.25,49.02) v1(28.25,46.48) v1(28.25,41.4) v1(28.25,38.86) v1(28.25,33.78) v1(28.25,31.24) v1(28.25,26.16) v1(28.25,23.62) v1(28.25,18.54) v1(28.25,16) v1(28.25,10.92) v1(28.25,8.38) v1(28.25,0.76) v1(30.78,84.58) v1(30.78,82.04) v1(30.78,79.5) v1(30.78,74.42) v1(30.78,71.88) v1(30.78,66.8) v1(30.78,64.26) v1(30.78,61.72) v1(30.78,59.18) v1(30.78,56.64) v1(30.78,51.56) v1(30.78,49.02) v1(30.78,46.48) v1(30.78,43.94) v1(30.78,41.4) v1(30.78,38.86) v1(30.78,36.32) v1(30.78,33.78) v1(30.78,31.24) v1(30.78,28.7) v1(30.78,26.16) v1(30.78,23.62) v1(30.78,21.08) v1(30.78,18.54) v1(30.78,16) v1(30.78,13.46) v1(30.78,10.92) v1(30.78,8.38) v1(30.78,5.84) v1(30.78,3.3) v1(30.78,0.76) v1(33.32,84.58) v1(33.32,82.04) v1(33.32,79.5) v1(33.32,74.42) v1(33.32,71.88) v1(33.32,69.34) v1(33.32,66.8) v1(33.32,64.26) v1(33.32,59.18) v1(33.32,51.56) v1(33.32,49.02) v1(33.32,46.48) v1(33.32,43.94) v1(33.32,41.4) v1(33.32,38.86) v1(33.32,36.32) v1(33.32,33.78) v1(33.32,31.24) v1(33.32,28.7) v1(33.32,26.16) v1(33.32,23.62) v1(33.32,21.08) v1(33.32,18.54) v1(33.32,16) v1(33.32,13.46) v1(33.32,10.92) v1(33.32,8.38) v1(33.32,5.84) v1(33.32,3.3) v1(33.32,0.76) v1(35.87,94.74) v1(35.87,92.2) v1(35.87,84.58) v1(35.87,82.04) v1(35.87,71.88) v1(35.87,69.34) v1(35.87,51.56) v1(35.87,49.02) v1(35.87,46.48) v1(35.87,43.94) v1(35.87,41.4) v1(35.87,38.86) v1(35.87,36.32) v1(35.87,33.78) v1(35.87,31.24) v1(35.87,28.7) v1(35.87,26.16) v1(35.87,23.62) v1(35.87,21.08) v1(35.87,18.54) v1(35.87,16) v1(35.87,13.46) v1(35.87,10.92) v1(35.87,8.38) v1(35.87,5.84) v1(35.87,3.3) v1(35.87,0.76) v1(38.41,79.5) v1(38.41,71.88) v1(38.41,69.34) v1(38.41,66.8) v1(38.41,61.72) v1(38.41,59.18) v1(38.41,56.64) v1(38.41,0.76) v1(40.94,61.72) v1(40.94,59.18) v1(40.94,56.64) v1(40.94,51.56) v1(40.94,49.02) v1(40.94,46.48) v1(40.94,41.4) v1(40.94,38.86) v1(40.94,33.78) v1(40.94,31.24) v1(40.94,26.16) v1(40.94,23.62) v1(40.94,18.54) v1(40.94,16) v1(40.94,10.92) v1(40.94,8.38) v1(40.94,5.84) v1(40.94,0.76) v1(43.49,94.74) v1(43.49,92.2) v1(43.49,89.66) v1(43.49,87.12) v1(43.49,79.5) v1(43.49,71.88) v1(43.49,66.8) v1(43.49,64.26) v1(43.49,61.72) v1(43.49,59.18) v1(43.49,56.64) v1(43.49,51.56) v1(43.49,49.02) v1(43.49,46.48) v1(43.49,0.76) v1(46.03,92.2) v1(46.03,89.66) v1(46.03,87.12) v1(46.03,84.58) v1(46.03,82.04) v1(46.03,79.5) v1(46.03,74.42) v1(46.03,71.88) v1(46.03,69.34) v1(46.03,64.26) v1(46.03,61.72) v1(46.03,59.18) v1(46.03,54.1) v1(46.03,51.56) v1(46.03,49.02) v1(46.03,43.94) v1(46.03,41.4) v1(46.03,38.86) v1(46.03,36.32) v1(46.03,33.78) v1(46.03,31.24) v1(46.03,28.7) v1(46.03,26.16) v1(46.03,23.62) v1(46.03,21.08) v1(46.03,18.54) v1(46.03,16) v1(46.03,13.46) v1(46.03,10.92) v1(46.03,8.38) v1(46.03,5.84) v1(46.03,3.3) v1(46.03,0.76) v1(48.56,76.96) v1(48.56,71.88) v1(48.56,69.34) v1(48.56,66.8) v1(48.56,61.72) v1(48.56,59.18) v1(48.56,56.64) v1(48.56,51.56) v1(48.56,49.02) v1(48.56,46.48) v1(48.56,43.94) v1(48.56,41.4) v1(48.56,38.86) v1(48.56,36.32) v1(48.56,33.78) v1(48.56,31.24) v1(48.56,28.7) v1(48.56,26.16) v1(48.56,23.62) v1(48.56,21.08) v1(48.56,18.54) v1(48.56,16) v1(48.56,13.46) v1(48.56,10.92) v1(48.56,8.38) v1(48.56,5.84) v1(48.56,3.3) v1(48.56,0.76) v1(51.1,76.96) v1(51.1,71.88) v1(51.1,69.34) v1(51.1,49.02) v1(51.1,46.48) v1(51.1,43.94) v1(51.1,41.4) v1(51.1,38.86) v1(51.1,36.32) v1(51.1,33.78) v1(51.1,31.24) v1(51.1,28.7) v1(51.1,26.16) v1(51.1,23.62) v1(51.1,21.08) v1(51.1,18.54) v1(51.1,16) v1(51.1,13.46) v1(51.1,10.92) v1(51.1,8.38) v1(51.1,5.84) v1(51.1,3.3) v1(51.1,0.76) v1(53.65,97.28) v1(53.65,94.74) v1(53.65,76.96) v1(53.65,71.88) v1(53.65,69.34) v1(53.65,64.26) v1(53.65,61.72) v1(53.65,59.18) v1(53.65,56.64) v1(53.65,54.1) v1(53.65,51.56) v1(53.65,46.48) v1(53.65,41.4) v1(53.65,38.86) v1(53.65,33.78) v1(53.65,31.24) v1(53.65,26.16) v1(53.65,23.62) v1(53.65,18.54) v1(53.65,16) v1(53.65,10.92) v1(53.65,8.38) v1(53.65,5.84) v1(53.65,3.3) v1(53.65,0.76) v1(56.19,92.2) v1(56.19,89.66) v1(56.19,87.12) v1(56.19,84.58) v1(56.19,66.8) v1(56.19,64.26) v1(56.19,61.72) v1(56.19,59.18) v1(56.19,56.64) v1(56.19,51.56) v1(56.19,49.02) v1(56.19,46.48) v1(56.19,41.4) v1(56.19,38.86) v1(56.19,33.78) v1(56.19,31.24) v1(56.19,26.16) v1(56.19,23.62) v1(56.19,18.54) v1(56.19,16) v1(56.19,10.92) v1(56.19,8.38) v1(56.19,0.76) v1(58.72,92.2) v1(58.72,89.66) v1(58.72,87.12) v1(58.72,84.58) v1(58.72,82.04) v1(58.72,79.5) v1(58.72,76.96) v1(58.72,74.42) v1(58.72,71.88) v1(58.72,69.34) v1(58.72,66.8) v1(58.72,64.26) v1(58.72,61.72) v1(58.72,59.18) v1(58.72,56.64) v1(58.72,54.1) v1(58.72,51.56) v1(58.72,49.02) v1(58.72,46.48) v1(58.72,43.94) v1(58.72,41.4) v1(58.72,38.86) v1(58.72,36.32) v1(58.72,33.78) v1(58.72,31.24) v1(58.72,28.7) v1(58.72,26.16) v1(58.72,23.62) v1(58.72,21.08) v1(58.72,18.54) v1(58.72,16) v1(58.72,13.46) v1(58.72,10.92) v1(58.72,8.38) v1(58.72,5.84)
VCC: length 58.7
  Top Layer w0.762: v1(26.54,75.49) 26.54,74.09 C7.1 26.29,67.49 25.27,66.47 U3.1 ; U1.1 53.59,66.47 55.76,68.63 C1.1 55.76,77.1 52.16,80.7 49.52,80.7 SW1.4
  Bottom Layer w0.762: SW1.4 44.63,76.63 27.69,76.63 v1(26.54,75.49)
VEE: length 74.8
  Top Layer w0.762: SW1.1 43.57,80.57 D2.1 41.79,80.02 C4.2 41.79,65.97 39.5,63.68 35.18,63.68 U2.2 ; U4.2 9.69,64.06 12.19,64.06 13.34,65.2 C10.2 13.46,73.96 v1(13.46,75.49)
  Bottom Layer w0.762: SW1.1 43.35,80.35 15.53,80.35 13.46,78.28 v1(13.46,75.49)
$1N38: length 1.8
  Top Layer w0.254: R1.2 27.6,81.65 VCC1.1
$1N41: length 1.8
  Top Layer w0.254: R2.2 20.58,81.75 VCC2.1
$1N46: length 1.7
  Top Layer w0.254: VEE1.2 24.25,81.86 R3.2
$1N47: length 1.7
  Top Layer w0.254: R4.2 16.95,81.85 VEE2.2

## Copper pours and planes (outline as drawn; the poured copper is in the pictures)
GND on Top Layer: 0,100.96 60.16,100.96 60.16,-0.33 0,-0.33
GND on Bottom Layer: -0.13,100.13 60.45,100.13 60.45,-0.33 -0.13,-0.33
VCC_IN on Top Layer: 48.4,96.48 52.83,96.48 52.96,96.35 52.96,92.28 54.21,91.02 54.21,82.88 53.81,82.47 48.51,82.47 48.4,82.59
VCC_IN on Top Layer: 29.01,91.53 29.01,98.66 29.34,98.98 51.82,98.98 52.45,98.35 52.45,92.63 51.94,92.13 49.15,92.13 48.64,92.63 48.64,96.28 48.44,96.48 35.22,96.48 34.8,96.06 34.8,91.46 29.08,91.46
VEE_IN on Top Layer: 7.42,96.53 12.91,96.53 12.95,96.57 13.15,96.53 13.34,96.44 13.34,89.97 13.69,89.62 37.72,89.62 37.72,95.17 38.35,95.81 41.78,95.81 41.78,82.86 41.4,82.47 38.1,82.47 37.47,83.11 37.47,86.03 36.45,87.05 8,87.05 7.87,86.92 7.42,87.37
VEE_IN on Top Layer: 37.59,86.28 44.45,86.28 45.34,85.39 45.34,82.6 45.21,82.47 40.64,82.47 40.64,83.24

## Text on the board
Top Silkscreen Layer: G | + | _ | Up：杂粮煎饼大王
